# Altium schematic sheet USBserial.SchDoc
size A4
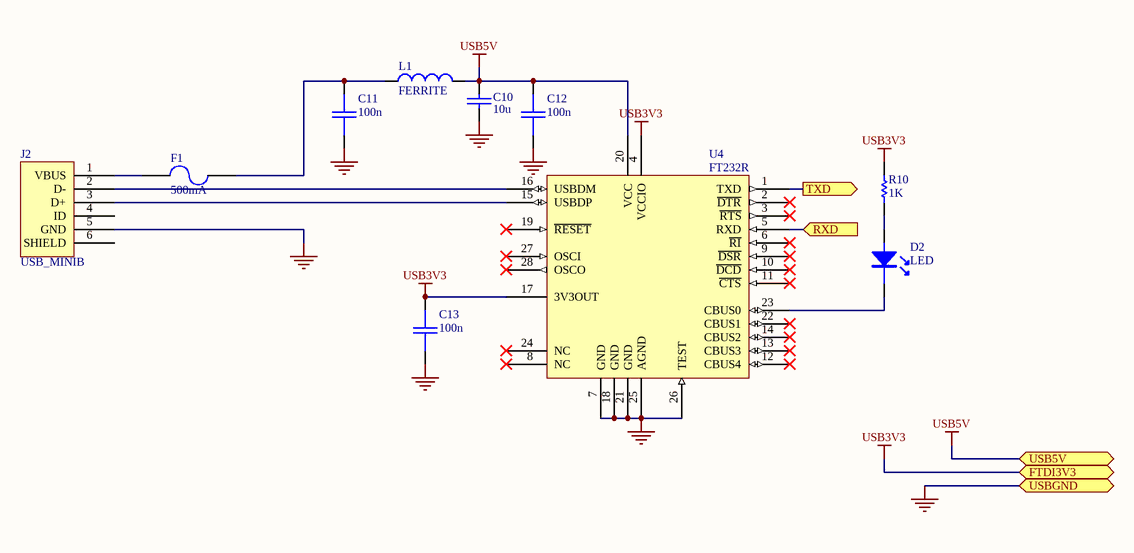
[diagram p0: USBserial.SchDoc]

## Parts
C10  10u  [0805]
C11  100n  [0603]
C12  100n  [0603]
C13  100n  [0603]
D2  LED  [0805LED]
F1  500mA  [LITTELFUSE-154]
J2  USB_MINIB  [USB/SM0.8-6H5]
L1  FERRITE  [0603]
R10  1K  [0603]
U4  FT232R  [SSOP28w]

## Ports
FTDI3V3, RXD (in), TXD (out), USB5V, USBGND

## Nets
USB3V3: C13.1 R10.2 U4.4(VCCIO) U4.17(3V3OUT) ; port FTDI3V3
USB5V: C10.2 C12.1 L1.2 U4.20(VCC) ; port USB5V
USBGND: C10.1 C11.2 C12.2 C13.2 J2.5(GND) U4.7(GND) U4.18(GND) U4.21(GND) U4.25(AGND) U4.26(TEST) ; port USBGND
RXD: U4.5(RXD) ; port RXD
TXD: U4.1(TXD) ; port TXD
NetC11_1: C11.1 F1.2 L1.1
NetD2_A: D2.A R10.1
NetD2_K: D2.K U4.23(CBUS0)
NetF1_1: F1.1 J2.1(VBUS)
NetJ2_2: J2.2(D-) U4.16(USBDM)
NetJ2_3: J2.3(D+) U4.15(USBDP)

Not connected (* = marked no-connect by the designer): J2 4(ID) 6(SHIELD); U4 2(~{DTR})* 3(~{RTS})* 6(~{RI})* 8(NC)* 9(~{DSR})* 10(~{DCD})* 11(~{CTS})* 12(CBUS4)* 13(CBUS3)* 14(CBUS2)* 19(~{RESET})* 22(CBUS1)* 24(NC)* 27(OSCI)* 28(OSCO)*

## Library data of the parts
C10-C13 = CAP: Capacitor
  C10: Element14: 1458902RL; Element14 Price: 0.69
  C11-C13: Element14: 9406140; Element14 Price: 0.13
F1 = FUSE2: Fuse; Element14 Price: 4.60 (min 10); Element14 (low stock): 9943625(holder+fuse); Digikey: F1301CT-ND(holder+fuse); Digikey Price: 3.96
J2 = USB_miniB_SMT: USB Mini B Connector; Element14: 9786473; Element14 Price: $3.08
L1 = INDUCTOR: Manufacturer: Generic Components; Revision: July-2002: Re-released for DXP Platform.; Element14: 1308773; Element14 Price: 0.72
R10 = Res Semi: Semiconductor Resistor; Value: 1K; Element14: Stock
U4 = FT232R: USB UART IC; Element14: 1146032; Cost: 7.94